# Altium schematic sheet Liv_Flo_Sign_MCU_V1.0.SchDoc: Liv-Flo Sign
size A4; PageSetup: Record=PageOptions|CenterHorizontal=True|CenterVertical=True|PrintScale=0.97|XCorrection=1.00|YCorrection=1.00|PrintKind=0|BorderSize=5000000|LeftOffset=0|BottomOffset=0|Orientation=2|PaperLength=1000|PaperWidth=1000|Scale=100|PaperSource=7|PrintQuality=-3|MediaType=1|DitherType=10|PrintScaleMode=1|PaperKind=A4|PaperIndex=9; Organization: Crelin; Address2: Florian Baumgartner; DocumentNumber: MCU; Revision: V1.0; SheetNumber: 1; SheetTotal: 2; Author: Florian Baumgartner; Subtitle: Vertically Mounted Daughter-Board
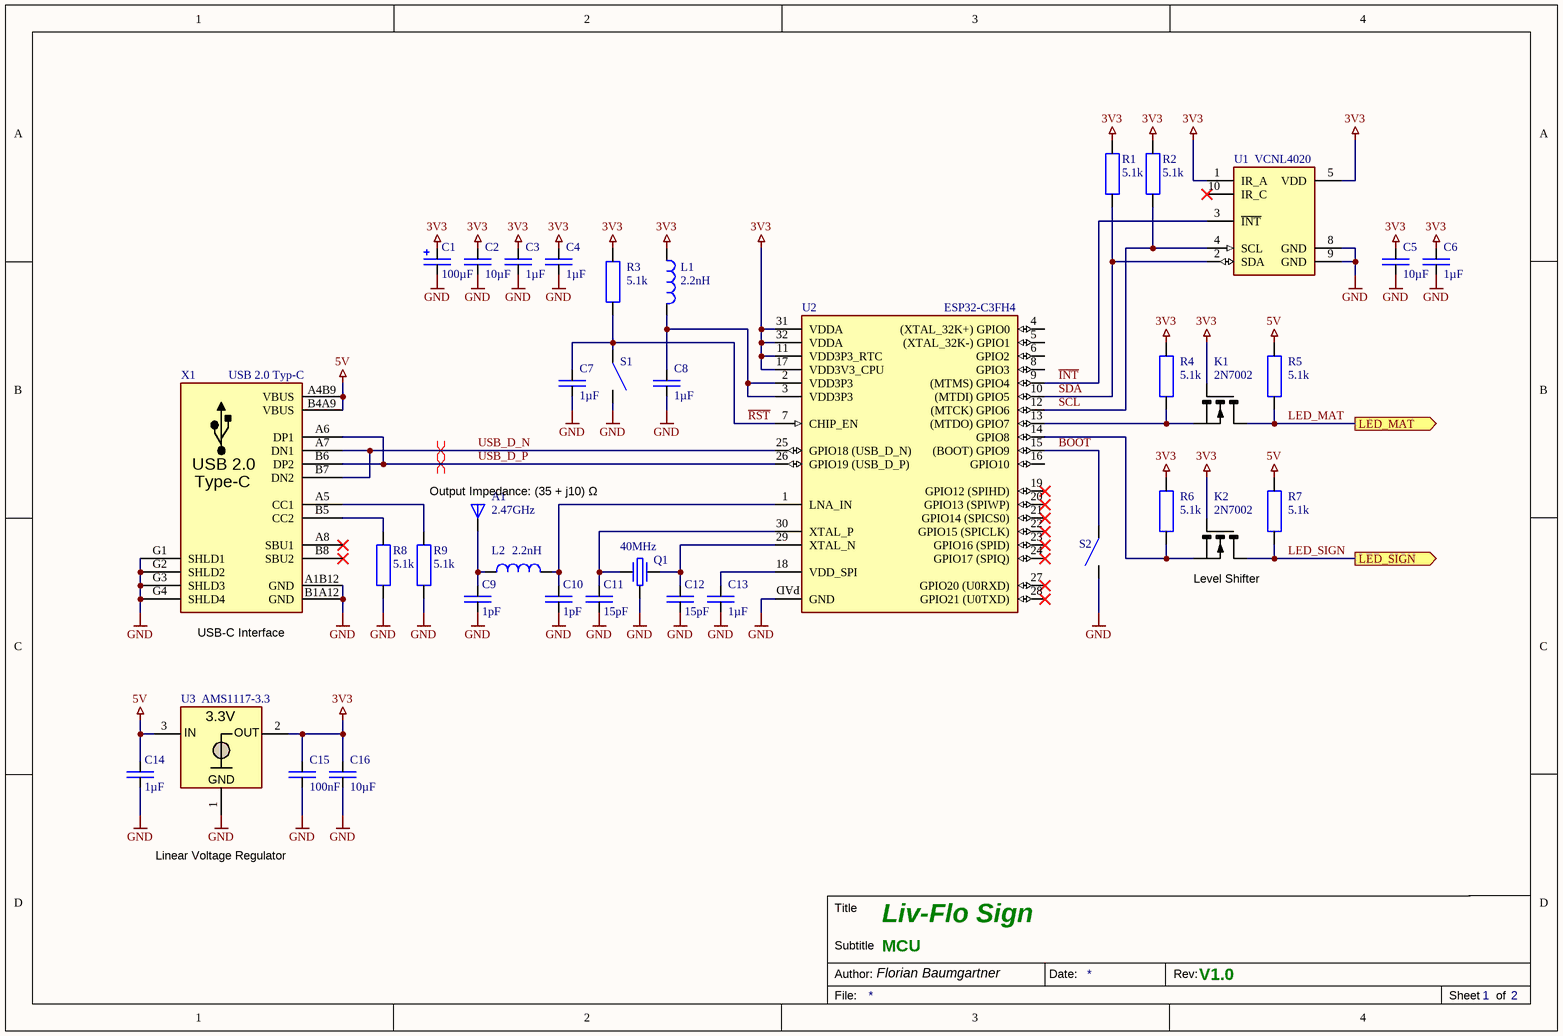
[diagram p0: Liv_Flo_Sign_MCU_V1.0.SchDoc]

## Parts
A1  2.47GHz  [SMD Chip-Antenna 7020 (SLDA72-2R470G-S1TF)]
C1  100µF  [SMD Tantalkondensator 1210 +]
C2  10µF  [SMD Keramikkondensator 0603]
C3  1µF  [SMD Keramikkondensator 0603]
C4  1µF  [SMD Keramikkondensator 0603]
C5  10µF  [SMD Keramikkondensator 0603]
C6  1µF  [SMD Keramikkondensator 0603]
C7  1µF  [SMD Keramikkondensator 0603]
C8  1µF  [SMD Keramikkondensator 0603]
C9  1pF  [SMD Keramikkondensator 0402]
C10  1pF  [SMD Keramikkondensator 0402]
C11  15pF  [SMD Keramikkondensator 0603]
C12  15pF  [SMD Keramikkondensator 0603]
C13  1µF  [SMD Keramikkondensator 0603]
C14  1µF  [SMD Keramikkondensator 0603]
C15  100nF  [SMD Keramikkondensator 0603]
C16  10µF  [SMD Keramikkondensator 0603]
K1  2N7002  [SMD MOSFET SOT-23]
K2  2N7002  [SMD MOSFET SOT-23]
L1  2.2nH  [SMD Inductor 0402]
L2  2.2nH  [SMD Inductor 0402]
Q1  40MHz  [SMD Crystal 2.5X2.0X0.5]
R1  5.1k  [SMD Widerstand 0603]
R2  5.1k  [SMD Widerstand 0603]
R3  5.1k  [SMD Widerstand 0603]
R4  5.1k  [SMD Widerstand 0603]
R5  5.1k  [SMD Widerstand 0603]
R6  5.1k  [SMD Widerstand 0603]
R7  5.1k  [SMD Widerstand 0603]
R8  5.1k  [SMD Widerstand 0603]
R9  5.1k  [SMD Widerstand 0603]
S1  SMD-Button  [SMD Button 4.2x3.2x2.5]  (value not drawn)
S2  SMD-Button  [SMD Button 4.2x3.2x2.5]  (value not drawn)
U1  VCNL4020  [SMD Proximity Sensor (VCNL4020)]
U2  ESP32-C3FH4  [SMD IC QFN-32]
U3  AMS1117-3.3  [SMD IC SOT-223]
X1  USB 2.0 Typ-C  [SMD USB-C Socket (A40-00119)]

## Ports
LED_MAT (out), LED_SIGN (out)

## Nets
3V3: C1.P(+) C2.2 C3.2 C4.2 C5.2 C6.2 C15.2 C16.2 K1.G K2.G L1.1 R1.1 R2.1 R3.1 R4.1 R6.1 U1.1(IR_A) U1.5(VDD) U2.11(VDD3P3_RTC) U2.17(VDD3V3_CPU) U2.31(VDDA) U2.32(VDDA) U3.2(OUT)
5V: C14.2 R5.1 R7.1 U3.3(IN) X1.A4B9(VBUS) X1.B4A9(VBUS)
GND: C1.M(-) C2.1 C3.1 C4.1 C5.1 C6.1 C7.1 C8.1 C9.2 C10.2 C11.2 C12.2 C13.1 C14.1 C15.1 C16.1 Q1.3 R8.2 R9.2 S1.2 S2.2 U1.8(GND) U1.9(GND) U2.PAD(GND) U3.1(GND) X1.A1B12(GND) X1.B1A12(GND) X1.G1(SHLD1) X1.G2(SHLD2) X1.G3(SHLD3) X1.G4(SHLD4)
BOOT: S2.1 U2.15((BOOT)_GPIO9)
~{INT}: U1.3(~{INT}) U2.9((MTMS)_GPIO4)
LED_MAT: K1.D R5.2 ; port LED_MAT
LED_SIGN: K2.D R7.2 ; port LED_SIGN
~{RST}: C7.2 R3.2 S1.1 U2.7(CHIP_EN)
SCL: R2.2 U1.4(SCL) U2.12((MTCK)_GPIO6)
SDA: R1.2 U1.2(SDA) U2.10((MTDI)_GPIO5)
USB_D_N: U2.25(GPIO18_(USB_D_N)) X1.A7(DN1) X1.B7(DN2)
USB_D_P: U2.26(GPIO19_(USB_D_P)) X1.A6(DP1) X1.B6(DP2)
NetA1_1: A1.1 C9.1 L2.1
NetC8_2: C8.2 L1.2 U2.2(VDD3P3) U2.3(VDD3P3)
NetC10_1: C10.1 L2.2 U2.1(LNA_IN)
NetC11_1: C11.1 Q1.1 U2.30(XTAL_P)
NetC12_1: C12.1 Q1.2 U2.29(XTAL_N)
NetC13_2: C13.2 U2.18(VDD_SPI)
NetK1_S: K1.S R4.2 U2.13((MTDO)_GPIO7)
NetK2_S: K2.S R6.2 U2.14(GPIO8)
NetR8_1: R8.1 X1.B5(CC2)
NetR9_1: R9.1 X1.A5(CC1)

Not connected (* = marked no-connect by the designer): U1 6(NC) 7(NC) 10(IR_C)*; U2 4((XTAL_32K+)_GPIO0) 5((XTAL_32K-)_GPIO1) 6(GPIO2) 8(GPIO3) 16(GPIO10) 19(GPIO12_(SPIHD))* 20(GPIO13_(SPIWP))* 21(GPIO14_(SPICS0))* 22(GPIO15_(SPICLK))* 23(GPIO16_(SPID))* 24(GPIO17_(SPIQ))* 27(GPIO20_(U0RXD))* 28(GPIO21_(U0TXD))*; X1 A8(SBU1)* B8(SBU2)*

## Layout directives
differential pair: USB_D_N, USB_D_P

## Notes on the sheet
- (near U2) Output Impedance: (35 + j10) Ω
- (near K2) Level Shifter
- (near X1) USB-C Interface
- Linear Voltage Regulator
- Title
- Author:
- Subtitle
- Date:
- Rev:
- File:
- Sheet
- of
- (in symbol U-AMS1117-3.3) 3.3V
- (in symbol X-USB-Buchse) USB 2.0; Type-C

## Library data of the parts
A1 = A-Chip-Antenna: Chip-Antenna; Component Value: SLDA72-2R470G-S1TF (2.47GHz); Digikey: 3442-SLDA72-2R470G-S1TFTR-ND; Component Description: Chip-Antenna; ComponentLink1Description: Datasheet; ComponentLink1URL: https://datasheet.lcsc.com/lcsc/2110081530_Sunlord-SLDA72-2R470G-S1TF_C370399.pdf; JLC-Parts: C370399; Unit Price: 0.20
C1 = C-ELCAP: CAP-Elko; Component Description: Tantalum Capacitor; Component Value: 100µF 6.3V; Digikey: 478-1677-1-ND; Farnell: 1135048; Mouser: 581-TAJB107K006R; JLC-Parts: C16133; Unit Price: 0.08
C2 C5 C16 = E6 - 10uF: SMD Ceramic Capacitor E6; Component Value: 10µF 10V; Component Description: Multilayer Ceramic Capacitors MLCC; ComponentLink1Description: Datasheet; ComponentLink1URL: https://datasheet.lcsc.com/lcsc/1810191219_Samsung-Electro-Mechanics-CL10A106KP8NNNC_C19702.pdf; Digikey: 587-3258-1-ND; Farnell: 2113070; JLC-Parts: C19702; Mouser: 963-LMK107BBJ106MALT; Unit Price: 0.01
C3 C4 C6-C8 C13 = C-CAPACITOR: CAP-MK; Component Description: Multilayer Ceramic Capacitors MLCC; Component Value: 1µF 50V; Digikey: 1276-1860-1-ND; Farnell: 3013383; Mouser: 187-CL10A105KB8NNNC; ComponentLink1Description: Datasheet; ComponentLink1URL: https://datasheet.lcsc.com/lcsc/1810261812_Samsung-Electro-Mechanics-CL10A105KB8NNNC_C15849.pdf; JLC-Parts: C15849; Unit Price: 0.01
C9 C10 = C-CAPACITOR: CAP-MK; Component Description: Multilayer Ceramic Capacitors; Component Value: 1pF 50V; Digikey: 490-13288-1-ND; Farnell: 3581492; Mouser: 81-GCM1555C1H1R0CA6D; JLC-Parts: C161149; Unit Price: 0.01
C11 C12 = C-CAPACITOR: CAP-MK; Component Description: Multilayer Ceramic Capacitors; Component Value: 15pF 50V; Digikey: 399-C0603C150J5GAC7867CT-ND; Farnell: 1414614; Mouser: 80-C0603C150J5G; JLC-Parts: C1644; Unit Price: 0.01
C14 = E6 - 1uF: SMD Ceramic Capacitor E6; Component Value: 1µF 50V; Component Description: Multilayer Ceramic Capacitors MLCC; ComponentLink1Description: Datasheet; ComponentLink1URL: https://datasheet.lcsc.com/lcsc/1810261812_Samsung-Electro-Mechanics-CL10A105KB8NNNC_C15849.pdf; Digikey: 1276-1860-1-ND; Farnell: 3013383; JLC-Parts: C15849; Mouser: 187-CL10A105KB8NNNC; Unit Price: 0.01
C15 = E6 - 100nF: SMD Ceramic Capacitor E6; Component Value: 100nF 50V; Component Description: Multilayer Ceramic Capacitors MLCC; ComponentLink1Description: Datasheet; ComponentLink1URL: https://datasheet.lcsc.com/lcsc/1809301912_YAGEO-CC0603KRX7R9BB104_C14663.pdf; Digikey: 445-6899-1-ND; Farnell: 2210822; JLC-Parts: C14663; Mouser: 810-CGA2B3X7R1H104K; Unit Price: 0.01
K1 K2 = K-FET:NIGE: MOSFET N-Channel; Digikey: 2N7002NCT-ND; Farnell: 1713823; Mouser: 512-2N7002; ComponentLink1Description: Datasheet; ComponentLink1URL: https://datasheet.lcsc.com/lcsc/1810151612_Jiangsu-Changjing-Electronics-Technology-Co---Ltd--2N7002_C8545.pdf; Component Description: MOSFET N-Channel; Component Value: 2N7002; JLC-Parts: C8545; Unit Price: 0.02
L1 L2 = R-COIL (HF): Chip Inductor; Farnell: 1343064; Mouser: 81-LQG15HN2N2S02D; Digikey: 490-1077-1-ND; Component Description: Chip Inductor; Component Value: 2.2nH; JLC-Parts: C918998; Unit Price: 0.01
Q1 = B-QUARZ-CAP: Component Description: Crystal; Digikey: XC2730CT-ND; Farnell: 4059221; Mouser: 520-400-8-36Q-CWYT; ComponentLink1Description: Datasheet; ComponentLink1URL: https://ecsxtal.com/store/pdf/ECX-2236Q.pdf; Component Value: 40Mhz; JLC-Parts: C524681; Unit Price: 0.16
R1-R9 = R-RESISTOR: RES (E=Heizwiderstand B=Messwandler); Component Description: Thick Film Chip Resistor; Component Value: 5.1k (75V, 100mW, 1%); Digikey: P5.10KHCT-ND; Farnell: 2059378; Mouser: 667-ERJ-3EKF5101V; JLC-Parts: C23186; Unit Price: 0.01
S1 S2 = Button 3mmx2.5mm: Button SPST; Component Value: SKRPACE010; Component Description: Tactile Switch; Digikey: 4809-SKRPACE010CT-ND; ComponentLink1Description: Datasheet; ComponentLink1URL: https://datasheet.lcsc.com/lcsc/1811051610_ALPSALPINE-SKRPACE010_C139797.pdf; Farnell: 3261825; JLC-Parts: C139797; Mouser: 688-SKRPACE010; Unit Price: 0.04
U1 = U-VCNL4020-GS08: Proximity and Ambient Light Sensor; Digikey: VCNL4020-GS08CT-ND; Farnell: 2251457; Mouser: 78-VCNL4020-GS08; ComponentLink1Description: Datasheet; ComponentLink1URL: https://www.vishay.com/docs/84276/veml6040.pdf; Component Description: Proximity and Ambient Light Sensor; Component Value: VCNL4020-GS08; JLC-Parts: C511034; Unit Price: 1.03
U2 = U-ESP32-C3FH4: 2.4 GHz Wi­Fi + Bluetooth® LE SoC; Digikey: 1904-ESP32-C3FH4CT-ND; Mouser: 356-ESP32-C3FH4; ComponentLink1Description: Datasheet; ComponentLink1URL: https://www.lcsc.com/datasheet/lcsc_datasheet_2312201733_Espressif-Systems-ESP32-C3FH4_C2858491.pdf; JLC-Parts: C2858491; Component Description: 2.4 GHz Wi­Fi + Bluetooth® LE SoC; Component Value: ESP32-C3FH4; Unit Price: 1.57
U3 = U-AMS1117-3.3: LDO Voltage Regulator; Component Value: AMS1117-3.3 (3.3V, 1A); Digikey: LM1117IMP-3.3/NOPBCT-ND; Farnell: 3116241; Mouser: 926-LM1117IMP3.3NOPB; ComponentLink1Description: Datasheet; ComponentLink1URL: https://datasheet.lcsc.com/lcsc/1811142212_Advanced-Monolithic-Systems-AMS1117-3-3_C6186.pdf; JLC-Parts: C6186; Component Description: LDO Voltage Regulator; Unit Price: 0.12
X1 = X-USB-Buchse: Typ-C; aliExpress: 33045191307; Component Description: USB Connector Type-C; Component Value: USB4105-GF-A; Digikey: 2073-USB4105-GF-ACT-ND; Farnell: 3583366; ComponentLink1Description: Datasheet; ComponentLink1URL: https://datasheet.lcsc.com/lcsc/2103051833_Jing-Extension-of-the-Electronic-Co--918-418K2023S40001_C167321.pdf; JLC-Parts: C167321; Unit Price: 0.34